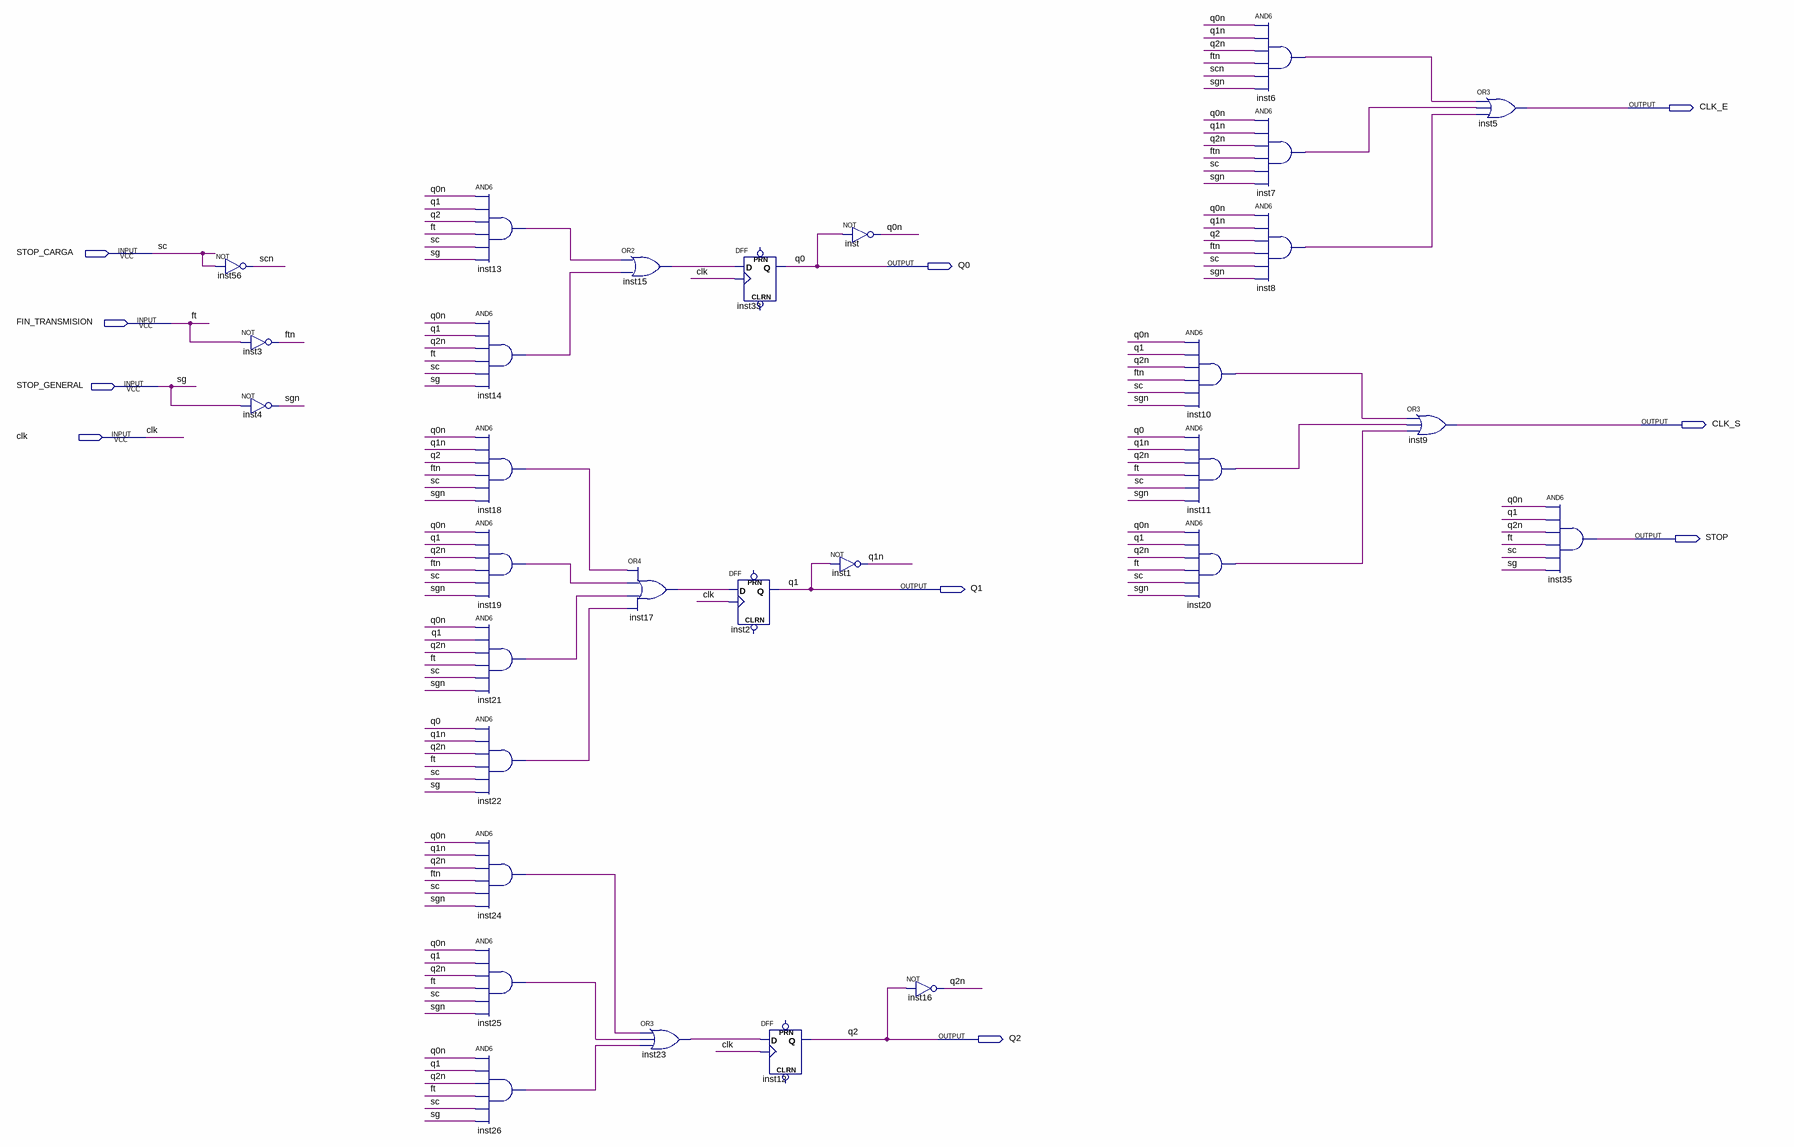
[diagram p0: schematic sheet]
// Quartus schematic Maquina_de_estado_general.bdf as structural Verilog: 30 symbols, 10 pins
module Maquina_de_estado_general (
  input  STOP_CARGA,
  input  FIN_TRANSMISION,
  input  STOP_GENERAL,
  input  clk,
  output CLK_E,
  output Q0,
  output CLK_S,
  output STOP,
  output Q1,
  output Q2
);

  wire ftn, inst6_out, inst7_out, inst8_out, inst10_out, inst11_out, inst13_out, inst14_out, inst15_out,
       inst17_out, inst18_out, inst19_out, inst20_out, inst21_out, inst22_out, inst23_out, inst24_out,
       inst25_out, inst26_out, q0n, q1n, q2n, scn, sgn;

  not inst56 (scn, STOP_CARGA);
  not inst3 (ftn, FIN_TRANSMISION);
  not inst4 (sgn, STOP_GENERAL);
  and inst13 (inst13_out, q0n, Q1, Q2, FIN_TRANSMISION, STOP_CARGA, STOP_GENERAL);
  and inst14 (inst14_out, q0n, Q1, q2n, FIN_TRANSMISION, STOP_CARGA, STOP_GENERAL);
  and inst18 (inst18_out, q0n, q1n, Q2, ftn, STOP_CARGA, sgn);
  and inst19 (inst19_out, q0n, Q1, q2n, ftn, STOP_CARGA, sgn);
  and inst21 (inst21_out, q0n, Q1, q2n, FIN_TRANSMISION, STOP_CARGA, sgn);
  and inst22 (inst22_out, Q0, q1n, q2n, FIN_TRANSMISION, STOP_CARGA, STOP_GENERAL);
  and inst24 (inst24_out, q0n, q1n, q2n, ftn, STOP_CARGA, sgn);
  and inst25 (inst25_out, q0n, Q1, q2n, FIN_TRANSMISION, STOP_CARGA, sgn);
  and inst26 (inst26_out, q0n, Q1, q2n, FIN_TRANSMISION, STOP_CARGA, STOP_GENERAL);
  or inst15 (inst15_out, inst13_out, inst14_out);
  or inst17 (inst17_out, inst18_out, inst19_out, inst21_out, inst22_out);
  or inst23 (inst23_out, inst24_out, inst25_out, inst26_out);
  DFF inst33 (.CLK(clk), .D(inst15_out), .Q(Q0));  // open: CLRN, PRN
  DFF inst2 (.CLK(clk), .D(inst17_out), .Q(Q1));  // open: CLRN, PRN
  DFF inst12 (.CLK(clk), .D(inst23_out), .Q(Q2));  // open: CLRN, PRN
  not inst (q0n, Q0);
  not inst1 (q1n, Q1);
  not inst16 (q2n, Q2);
  and inst10 (inst10_out, q0n, Q1, q2n, ftn, STOP_CARGA, sgn);
  and inst11 (inst11_out, Q0, q1n, q2n, FIN_TRANSMISION, STOP_CARGA, sgn);
  and inst20 (inst20_out, q0n, Q1, q2n, FIN_TRANSMISION, STOP_CARGA, sgn);
  and inst6 (inst6_out, q0n, q1n, q2n, ftn, scn, sgn);
  and inst7 (inst7_out, q0n, q1n, q2n, ftn, STOP_CARGA, sgn);
  and inst8 (inst8_out, q0n, q1n, Q2, ftn, STOP_CARGA, sgn);
  or inst9 (CLK_S, inst10_out, inst11_out, inst20_out);
  or inst5 (CLK_E, inst6_out, inst7_out, inst8_out);
  and inst35 (STOP, q0n, Q1, q2n, FIN_TRANSMISION, STOP_CARGA, STOP_GENERAL);

  // Other names for the same wires on the sheet: ft = FIN_TRANSMISION; sc = STOP_CARGA; sg = STOP_GENERAL
endmodule
